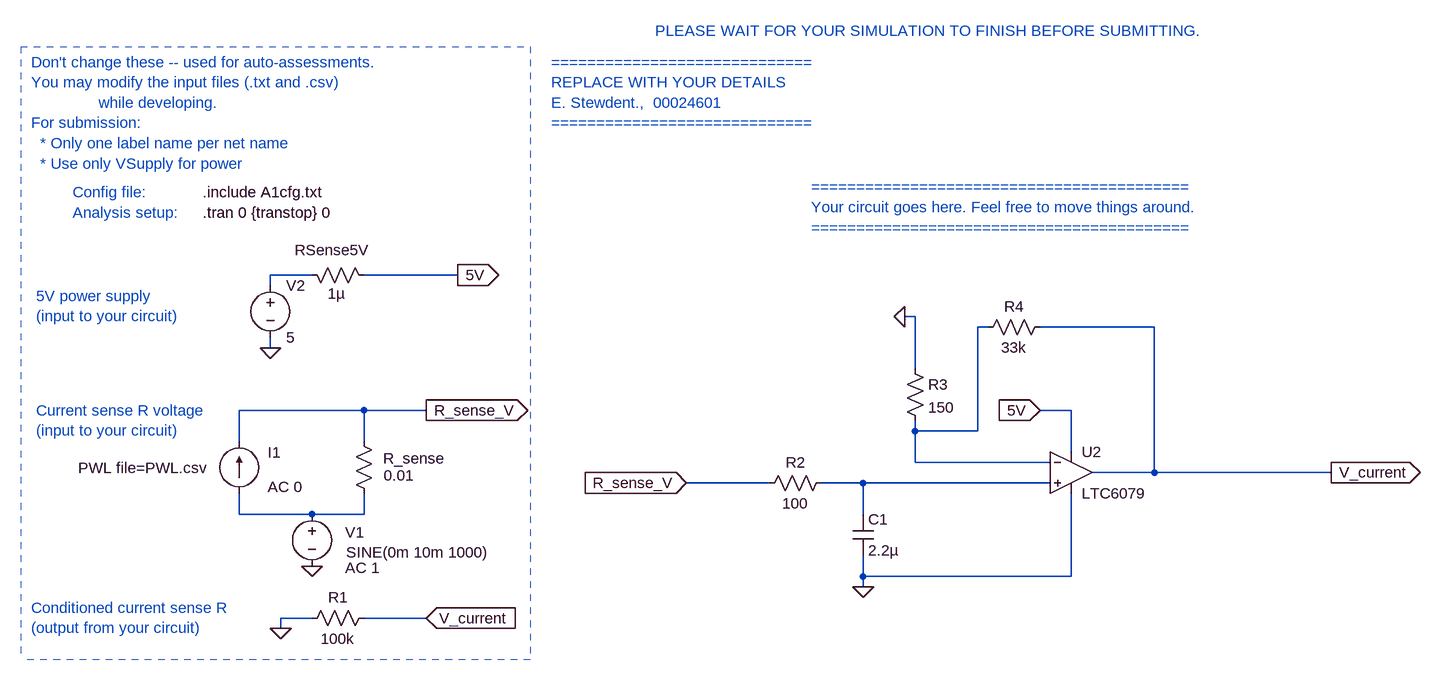
[diagram p0: schematic E344_Ass1_CurrSense.asc]
E344_Ass1_CurrSense.asc, the LTspice schematic file:
Version 4
SHEET 1 3140 2124
WIRE -1920 -1072 -1984 -1072
WIRE -1696 -1072 -1840 -1072
WIRE -1984 -1056 -1984 -1072
WIRE -992 -1008 -1008 -1008
WIRE -880 -992 -896 -992
WIRE -624 -992 -800 -992
WIRE -1984 -960 -1984 -976
WIRE -992 -928 -992 -1008
WIRE -1840 -864 -2032 -864
WIRE -1744 -864 -1840 -864
WIRE -752 -864 -800 -864
WIRE -992 -832 -992 -848
WIRE -896 -832 -896 -992
WIRE -896 -832 -992 -832
WIRE -2032 -816 -2032 -864
WIRE -1840 -816 -1840 -864
WIRE -752 -800 -752 -864
WIRE -992 -784 -992 -832
WIRE -784 -784 -992 -784
WIRE -624 -768 -624 -992
WIRE -624 -768 -720 -768
WIRE -352 -768 -624 -768
WIRE -1216 -752 -1344 -752
WIRE -1072 -752 -1136 -752
WIRE -784 -752 -1072 -752
WIRE -2032 -704 -2032 -736
WIRE -1920 -704 -2032 -704
WIRE -1840 -704 -1840 -736
WIRE -1840 -704 -1920 -704
WIRE -1072 -704 -1072 -752
WIRE -1072 -608 -1072 -640
WIRE -752 -608 -752 -736
WIRE -752 -608 -1072 -608
WIRE -1072 -592 -1072 -608
WIRE -1920 -544 -1968 -544
WIRE -1744 -544 -1840 -544
WIRE -1968 -528 -1968 -544
FLAG -1696 -1072 5V
IOPIN -1696 -1072 Out
FLAG -1984 -960 0
FLAG -800 -864 5V
IOPIN -800 -864 In
FLAG -1744 -864 R_sense_V
IOPIN -1744 -864 Out
FLAG -1920 -624 0
FLAG -352 -768 V_current
IOPIN -352 -768 Out
FLAG -1344 -752 R_sense_V
IOPIN -1344 -752 In
FLAG -1744 -544 V_current
IOPIN -1744 -544 In
FLAG -1968 -528 0
FLAG -1072 -592 0
FLAG -1008 -1008 0
SYMBOL voltage -1984 -1072 R0
WINDOW 123 0 0 Left 0
WINDOW 39 0 0 Left 0
SYMATTR InstName V2
SYMATTR Value 5
SYMBOL res -1936 -1088 M90
WINDOW 0 -7 47 VBottom 2
WINDOW 3 29 54 VTop 2
SYMATTR InstName RSense5V
SYMATTR Value 1µ
SYMBOL res -1824 -720 R180
WINDOW 0 -109 70 Left 2
WINDOW 3 -62 44 Left 2
SYMATTR InstName R_sense
SYMATTR Value 0.01
SYMBOL current -2032 -736 R180
WINDOW 0 -64 63 Left 2
WINDOW 3 248 39 Right 2
WINDOW 123 -97 10 Left 2
WINDOW 39 0 0 Left 0
SYMATTR InstName I1
SYMATTR Value PWL file=PWL.csv
SYMATTR Value2 AC 0
SYMBOL voltage -1920 -720 R0
WINDOW 0 66 60 Bottom 2
WINDOW 3 163 59 Top 2
WINDOW 123 78 114 Bottom 2
WINDOW 39 0 0 Left 0
SYMATTR InstName V1
SYMATTR Value SINE(0m 10m 1000)
SYMATTR Value2 AC 1
SYMBOL res -1824 -560 R90
WINDOW 0 0 56 VBottom 2
WINDOW 3 32 56 VTop 2
SYMATTR InstName R1
SYMATTR Value 100k
SYMBOL OpAmps\\LTC6079 -752 -768 R0
SYMATTR InstName U2
SYMBOL res -1120 -768 R90
WINDOW 0 0 56 VBottom 2
WINDOW 3 32 56 VTop 2
SYMATTR InstName R2
SYMATTR Value 100
SYMBOL cap -1088 -704 R0
SYMATTR InstName C1
SYMATTR Value 2.2µ
SYMBOL res -1008 -944 R0
SYMATTR InstName R3
SYMATTR Value 150
SYMBOL res -784 -1008 R90
WINDOW 0 0 56 VBottom 2
WINDOW 3 32 56 VTop 2
SYMATTR InstName R4
SYMATTR Value 33k
TEXT -2088 -1168 Left 2 !.tran 0 {transtop} 0
TEXT -2088 -1200 Left 2 !.include A1cfg.txt
TEXT -2352 -1400 Left 2 ;Don't change these -- used for auto-assessments.\nYou may modify the input files (.txt and .csv) \n               while developing.\nFor submission: \n  * Only one label name per net name\n  * Use only VSupply for power
TEXT -2288 -1200 Left 2 ;Config file:
TEXT -2288 -1168 Left 2 ;Analysis setup:
TEXT -1552 -1400 Left 2 ;=============================\nREPLACE WITH YOUR DETAILS\nE. Stewdent.,  00024601\n=============================
TEXT -1152 -1208 Left 2 ;==========================================\nYour circuit goes here. Feel free to move things around. \n==========================================
TEXT -1392 -1448 Left 2 ;PLEASE WAIT FOR YOUR SIMULATION TO FINISH BEFORE SUBMITTING.
TEXT -2344 -1040 Left 2 ;5V power supply\n(input to your circuit)
TEXT -2344 -864 Left 2 ;Current sense R voltage\n(input to your circuit)
TEXT -2352 -560 Left 2 ;Conditioned current sense R\n(output from your circuit)
LINE Normal -1584 -1424 -1584 -480 2
LINE Normal -2368 -1424 -1584 -1424 2
LINE Normal -1584 -480 -2368 -480 2
LINE Normal -1584 -496 -1584 -496 2
LINE Normal -2368 -1424 -2368 -480 2

The netlist it stands for:
* E344_Ass1_CurrSense.asc
V2 N001 0 5
RSense5V N001 5V 1µ
R_sense N004 R_sense_V 0.01
I1 N004 R_sense_V PWL file=PWL.csv AC 0
V1 N004 0 SINE(0m 10m 1000) AC 1
R1 V_current 0 100k
XU2 N003 N002 5V 0 V_current LTC6078  ; LTC6079, pins In+ In- V+ V- OUT
R2 N003 R_sense_V 100
C1 N003 0 2.2µ
R3 0 N002 150
R4 V_current N002 33k
.tran 0 {transtop} 0
.include A1cfg.txt
* Don't change these -- used for auto-assessments.
* You may modify the input files (.txt and .csv)
*                while developing.
* For submission:
*   * Only one label name per net name
*   * Use only VSupply for power
* Config file:
* Analysis setup:
* =============================
* REPLACE WITH YOUR DETAILS
* E. Stewdent.,  00024601
* =============================
* ==========================================
* Your circuit goes here. Feel free to move things around.
* ==========================================
* PLEASE WAIT FOR YOUR SIMULATION TO FINISH BEFORE SUBMITTING.
* 5V power supply
* (input to your circuit)
* Current sense R voltage
* (input to your circuit)
* Conditioned current sense R
* (output from your circuit)
.lib LTC5.lib
.backanno
.end